# EAGLE design okinesio_v01 (EAGLE 7.5.0)
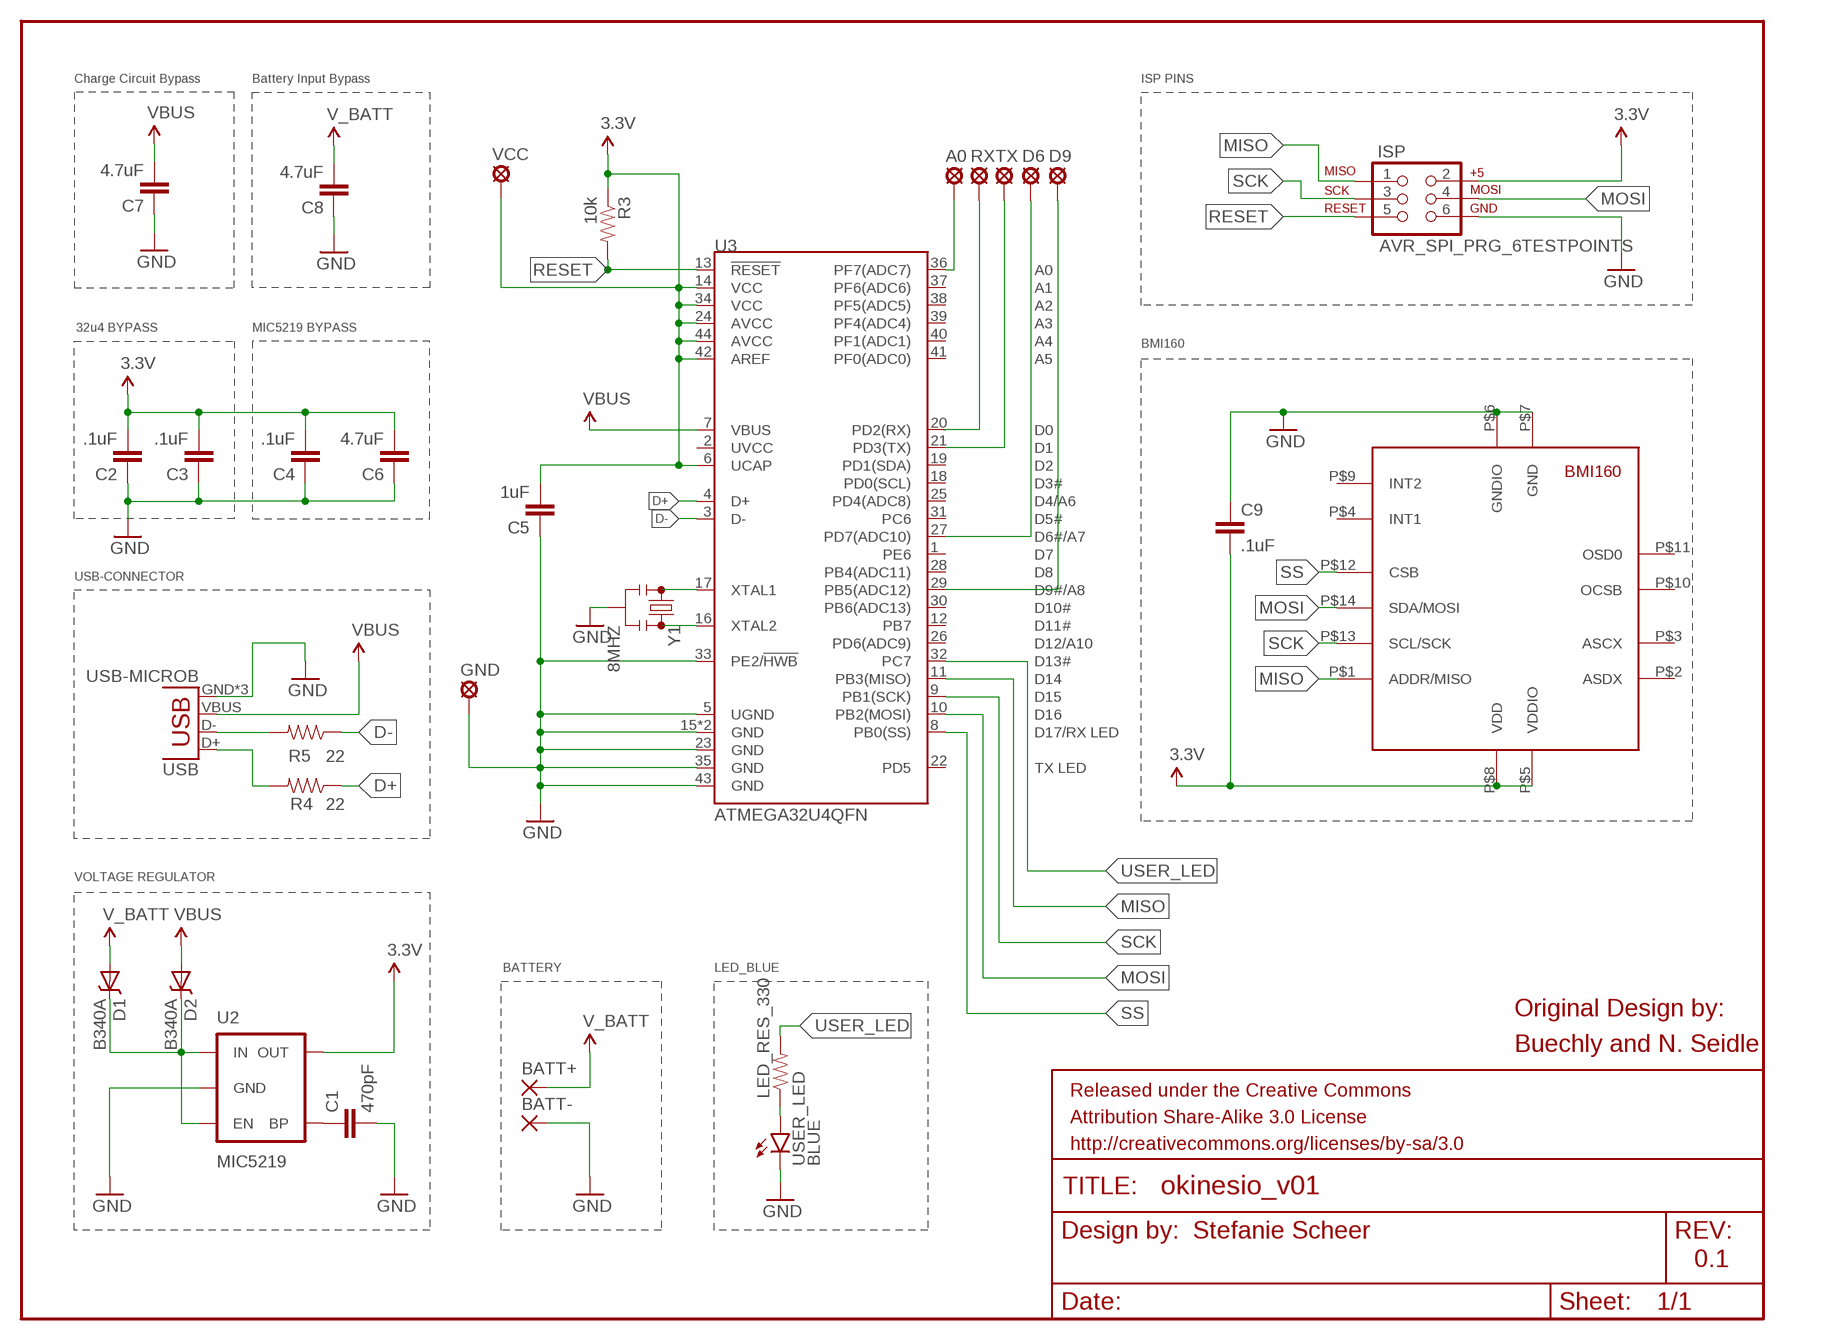
[diagram p0: schematic, sheet 1]

## Parts
A0  LSP10  [LSP10]
BATT+  SMD2  [SMD1,27-2,54]
BATT-  SMD2  [SMD1,27-2,54]
C1  470pF  CAP0603-CAP  [0603-CAP]
C2  .1uF  CAP0603-CAP  [0603-CAP]
C3  .1uF  CAP0603-CAP  [0603-CAP]
C4  .1uF  CAP0603-CAP  [0603-CAP]
C5  1uF  CAP0603-CAP  [0603-CAP]
C6  4.7uF  CAP0603-CAP  [0603-CAP]
C7  4.7uF  CAP1206  [1206]
C8  4.7uF  CAP1206  [1206]
C9  .1uF  CAP0603-CAP  [0603-CAP]
D1  B340A  DIODE-SCHOTTKY_  [SMA-DIODE]
D2  B340A  DIODE-SCHOTTKY_  [SMA-DIODE]
D6  LSP10  [LSP10]
D9  LSP10  [LSP10]
GND  LSP10  [LSP10]
ISP  AVR_SPI_PRG_6TESTPOINTS  [2X3_TEST_POINTS]
LED_RES_330  RESISTOR0603  [0603-RES]
R3  10k  RESISTOR0603-RES  [0603-RES]
R4  22  RESISTOR0603-RES  [0603-RES]
R5  22  RESISTOR0603-RES  [0603-RES]
RX  LSP10  [LSP10]
TX  LSP10  [LSP10]
U2  MIC5219  V_REG_MIC5219SMD  [SOT23-5]
U3  ATMEGA32U4QFN  [QFN-44]
U$3  BMI160LGA14  [LGA14-BMI160]
USB  USB-MICROB  [USB-MICROB]
USER_LED  BLUE  LED-BLUE0603  [LED-0603]
VCC  LSP10  [LSP10]
Y1  8MHZ  RESONATOR8MHZ  [RESONATOR-SMD]

## Nets
3.3V: C2.2 C3.2 C4.2 C5.2 C6.2 C9.2 ISP.2 R3.1 U2.5(OUT) U3.6(UCAP) U3.14(VCC) U3.24(AVCC) U3.34(VCC) U3.42(AREF) U3.44(AVCC) U$3.P$5(VDDIO) U$3.P$8(VDD) VCC.MP
5V: C7.2 D2.A U3.7(VBUS) USB.VBUS ; supply symbol labelled VBUS
D+: R4.1 U3.4(D+)
D-: R5.1 U3.3(D-)
GND: BATT-.1(P) C1.2 C2.1 C3.1 C4.1 C5.1 C6.1 C7.1 C8.1 C9.1 GND.MP ISP.6 U2.2(GND) U3.5(UGND) U3.15(GND) U3.23(GND) U3.33(PE2/!HWB) U3.35(GND) U3.43(GND) U3.EPAD(GND) U$3.P$6(GNDIO) U$3.P$7(GND) USB.GND USB.MT1(GND) USB.MT2(GND) USER_LED.C Y1.2
MISO: ISP.1 U3.11(PB3(MISO)) U$3.P$1(ADDR/MISO)
MOSI: ISP.4 U3.10(PB2(MOSI)) U$3.P$14(SDA/MOSI)
N$1: D1.C D2.C U2.1(IN) U2.3(EN)
N$2: D6.MP U3.27(PD7(ADC10))
N$3: TX.MP U3.21(PD3(TX))
N$4: A0.MP U3.36(PF7(ADC7))
N$5: U3.17(XTAL1) Y1.1
N$6: D9.MP U3.29(PB5(ADC12))
N$7: LED_RES_330.1 USER_LED.A
N$8: C1.1 U2.4(BP)
N$9: RX.MP U3.20(PD2(RX))
N$10: U3.16(XTAL2) Y1.3
N$13: R5.2 USB.D-
N$14: R4.2 USB.D+
RESET: ISP.5 R3.2 U3.13(!RESET)
SCK: ISP.3 U3.9(PB1(SCK)) U$3.P$13(SCL/SCK)
SS: U3.8(PB0(SS)) U$3.P$12(CSB)
USER_LED: LED_RES_330.2 U3.32(PC7)
V_BATT: BATT+.1(P) C8.2 D1.A
Unconnected: U3.1(PE6) U3.2(UVCC) U3.12(PB7) U3.18(PD0(SCL)) U3.19(PD1(SDA)) U3.22(PD5) U3.25(PD4(ADC8)) U3.26(PD6(ADC9)) U3.28(PB4(ADC11)) U3.30(PB6(ADC13)) U3.31(PC6) U3.37(PF6(ADC6)) U3.38(PF5(ADC5)) U3.39(PF4(ADC4)) U3.40(PF1(ADC1)) U3.41(PF0(ADC0)) U$3.P$2(ASDX) U$3.P$3(ASCX) U$3.P$4(INT1) U$3.P$9(INT2) U$3.P$10(OCSB) U$3.P$11(OSD0)

## Notes on the sheet
- Charge Circuit Bypass | Battery Input Bypass | ISP PINS
- 32u4 BYPASS | MIC5219 BYPASS
- BMI160
- USB-CONNECTOR
- VOLTAGE REGULATOR
- BATTERY | LED_BLUE
- Original Design by:
- Buechly and N. Seidle
- Stefanie Scheer
- 0.1

## Library data of the parts
A0 D6 D9 GND RX TX VCC = solpad:LSP10: SOLDER PAD drill 1.0 mm, distributor Buerklin, 12H555
BATT+ BATT- = wirepad_3x2:SMD2: SMD PAD
C1 = SparkFun-Passives:CAP: Capacitor Standard 0603 ceramic capacitor, and 0.1" leaded capacitor.; PROD_ID: CAP-07884
C2-C4 C9 = SparkFun-Passives:CAP: Capacitor Standard 0603 ceramic capacitor, and 0.1" leaded capacitor.; PROD_ID: CAP-00810
C5 = SparkFun-Passives:CAP: Capacitor Standard 0603 ceramic capacitor, and 0.1" leaded capacitor.; PROD_ID: CAP-00868
C6 = SparkFun-Passives:CAP: Capacitor Standard 0603 ceramic capacitor, and 0.1" leaded capacitor.; PROD_ID: CAP-08280
C7 C8 = SparkFun-Passives:CAP: Capacitor Standard 0603 ceramic capacitor, and 0.1" leaded capacitor.; PROD_ID: CAP-10300
D1 D2 = SparkFun-DiscreteSemi:DIODE-SCHOTTKY: Commonly MBRA140.; PROD_ID: DIO-09886
ISP = SparkFun-Connectors_usb_neu_2:AVR_SPI_PRG_6: AVR ISP 6 Pin This is the reduced ISP connector for AVR programming. Common on Arduino. This footprint will take up less PCB space and can be used with a 10-pin to 6-pin adapter such as SKU: BOB-08508 **Special note about "TEST_POINT" package. The stop mask is on the top side, so if you want your programming test points to be on the bottom of your board, make sure to place this package on the bottom side of the board. This also ensure that the orientation to program from the bottom side will be correct.
LED_RES_330 = SparkFun-Resistors:RESISTOR: Resistor Basic schematic elements and footprints for 0603, 1206, and PTH resistors.
R3 = SparkFun-Passives:RESISTOR: Resistor Basic schematic elements and footprints for 0603, 1206, and PTH resistors.; PROD_ID: RES-00824
R4 R5 = SparkFun-Passives:RESISTOR: Resistor Basic schematic elements and footprints for 0603, 1206, and PTH resistors.; PROD_ID: RES-08698
U2 = SparkFun-PowerIC:V_REG_MIC5219: V_REG MIC5219 Standard 500mA LDO voltage regulator in SOT-23 layout. Micrel part MIC5219. BP (by-pass) pin is used to lower output noise with 470pF cap, may be left open.; PROD_ID: VREG-09872
U3 = SparkFun-DigitalIC:ATMEGA32U4: Atmel 44-pin 8-bit Microcontroller with 32KBytes of ISP Flash and USB Controller; PROD_ID: IC-10828
U$3 = User-Submitted:BMI160: BMI160 Internal Measurement Unit
USB = SparkFun-Connectors_usb_neu_2:USB: USB Connectors USB-B-PTH is fully proven SKU : PRT-00139/CONN-08278 USB-miniB is fully proven SKU : PRT-00587 USB-A-PCB is untested. USB-A-H is throughly reviewed, but untested. Spark Fun Electronics SKU : PRT-00437 USB-B-SMT is throughly reviewed, but untested. Needs silkscreen touching up. USB-A-S has not been used/tested USB-MB-H has not been used/tested USB-MICROB has been used. CONN-09505; PROD_ID: CONN-09505
USER_LED = SparkFun-LED:LED-BLUE: Blue LEDs for production use Various blue LEDs stocked by SparkFun production 0603 - DIO-08575 Rebel - DIO-09553 1206 - DIO-09911; PROD_ID: DIO-08575
Y1 = SparkFun-FreqCtrl:RESONATOR: Resonator Small SMD resonator. Used, eg, on the Arduino Pro/ Pro Mini boards. 8MHz- XTAL-08895 16MHz- XTAL-08900; PROD_ID: XTAL-08895

## Board
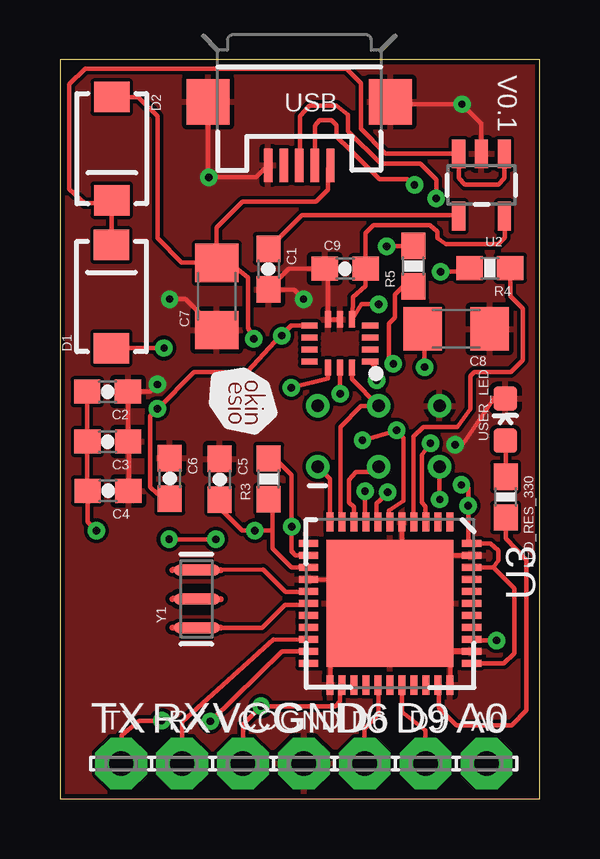
[diagram p1: board, top side]
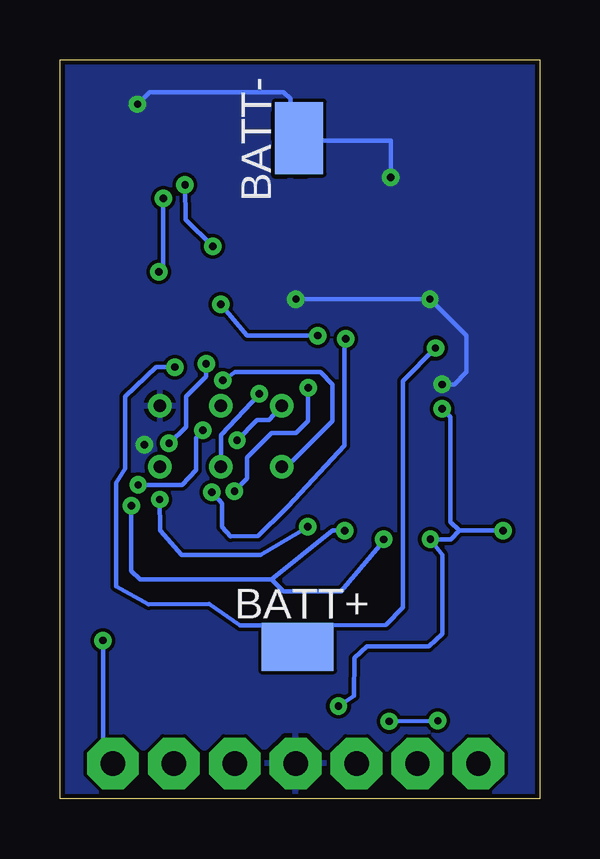
[diagram p2: board, bottom side, seen from below]

Size 20 x 30.8 mm. Coordinates in mm from the lower left corner, seen from the top.
Outline: 0,0 20,0 20,30.8 0,30.8 0,0
Copper layers (1*16): Top 0.035mm / dielectric 1.5mm / Bottom 0.035mm
Design rules "Eagle-DRU LochLP GmbH - 01 and 02 layers - 35mue *": minimum track width 0.15mm, minimum drill 0.3mm, track to track 0.15mm, track to pad 0.15mm, pad to pad 0.15mm, via to via 0.15mm, smd to smd 0.15mm, copper to edge 0.2mm, drill to drill 0.25mm, minimum pad ring 0.23mm, minimum via ring 0.21mm, stop-mask expansion 0.05mm, vias tented up to drill 12mil, thermal gap 0.2mm

### Footprints (pad centres in the part's own frame; a part is rotated, then mirrored left to right if it is on the bottom)
LSP10 = drill 1.016 pad 2.159 octagon: MP 0,0
SMD1,27-2,54 = smd 1.27 x 2.54: 1 0,0 | smd 2 x 3: P$1 0.362,0.235
0603-CAP = smd 1.1 x 1: 1 -0.85,0; 2 0.85,0
1206 = smd 1.6 x 1.8: 1 -1.4,0; 2 1.4,0
SMA-DIODE = smd 1.27 x 1.47: A -2.15,0; C 2.15,0
2X3_TEST_POINTS = drill 0.508: 1 -2.54,-1.27; 2 -2.54,1.27; 3 0,-1.27; 4 0,1.27; 5 2.54,-1.27; 6 2.54,1.27
0603-RES = smd 1.1 x 1: 1 -0.85,0; 2 0.85,0
SOT23-5 = smd 0.55 x 1.2: 1 -0.95,-1.3; 2 0,-1.3; 3 0.95,-1.3; 4 0.95,1.3; 5 -0.95,1.3
QFN-44 = smd 0.8 x 0.3: 1 -3.4,2.5; 2 -3.4,2; 3 -3.4,1.5; 4 -3.4,1; 5 -3.4,0.5; 6 -3.4,0; 7 -3.4,-0.5; 8 -3.4,-1; 9 -3.4,-1.5; 10 -3.4,-2; 11 -3.4,-2.5; 23 3.4,-2.5; 24 3.4,-2; 25 3.4,-1.5; 26 3.4,-1; 27 3.4,-0.5; 28 3.4,0; 29 3.4,0.5; 30 3.4,1; 31 3.4,1.5; 32 3.4,2; 33 3.4,2.5 | smd 0.3 x 0.8: 12 -2.5,-3.4; 13 -2,-3.4; 14 -1.5,-3.4; 15 -1,-3.4; 16 -0.5,-3.4; 17 0,-3.4; 18 0.5,-3.4; 19 1,-3.4; 20 1.5,-3.4; 21 2,-3.4; 22 2.5,-3.4; 34 2.5,3.4; 35 2,3.4; 36 1.5,3.4; 37 1,3.4; 38 0.5,3.4; 39 0,3.4; 40 -0.5,3.4; 41 -1,3.4; 42 -1.5,3.4; 43 -2,3.4; 44 -2.5,3.4 | smd 5.3 x 5.3: EPAD 0,0
LGA14-BMI160 = smd 0.675 x 0.25: P$1 -1.262,0.75; P$2 -1.262,0.25; P$3 -1.262,-0.25; P$4 -1.262,-0.75; P$8 1.262,-0.75; P$9 1.262,-0.25; P$10 1.262,0.25; P$11 1.262,0.75 | smd 0.25 x 0.675: P$5 -0.5,-1.012; P$6 0,-1.012; P$7 0.5,-1.012; P$12 0.5,1; P$13 0,1; P$14 -0.5,1
USB-MICROB = smd 0.35 x 1.4: D+ 0,2.65; D- -0.65,2.65; GND 1.3,2.65; ID 0.65,2.65; VBUS -1.3,2.65 | smd 1.8 x 1.9: MT1 -3.8,0; MT2 3.8,0
LED-0603 = smd 1 x 1: A 0,-0.877; C 0,0.877
RESONATOR-SMD = smd 0.45 x 1.905: 1 -1.2,0; 2 0,0; 3 1.2,0

### Placement (x,y rotation side)
A0  17.79,1.47 0 top
BATT+  10.32,6.7 270 bottom
BATT-  10.38,27.3 0 bottom
C1  8.7,22.08 270 top
C2  1.99,16.98 180 top
C3  2,14.89 180 top
C4  2.01,12.84 180 top
C5  6.67,13.32 270 top
C6  4.58,13.35 270 top
C7  6.54,20.94 90 top
C8  16.52,19.59 180 top
C9  11.9,22.1 0 top
D1  2.15,20.94 90 top
D2  2.16,27.1 270 top
D6  12.71,1.47 0 top
D9  15.25,1.47 0 top
GND  10.17,1.47 0 top
ISP  13.29,15.11 0 top
LED_RES_330  18.59,12.58 270 top
R3  8.71,13.34 90 top
R4  17.93,22.13 180 top
R5  14.74,22.2 90 top
RX  5.09,1.47 0 top
TX  2.55,1.47 0 top
U2  17.58,25.59 180 top
U3  13.77,8.14 270 top
U$3  11.67,18.97 180 top
USB  9.98,29.06 180 top
USER_LED  18.57,15.81 0 top
VCC  7.63,1.47 0 top
Y1  5.7,8.33 90 top

### Tracks (layer width: path | path; a pad name or v marks a point on that pad's centre or on a via)
3.3V  (via drill 0.3 pad 0.25)
  Top 0.178: 18.07,9.64 18.28,9.94 18.28,10.36 17.95,10.65 U3.44 17.02,10.78 v17.02,12.22 17.02,12.95 v16.74,13.09 | 18.07,9.64 U3.42 | U3.34 18.52,5.64 18.95,6.07 18.95,8.77 18.07,9.64 | 6.83,12.75 C5.2 6.67,12.16 6.63,12.13 7.59,11.18 v8.12,11.18 v8.13,11.18 8.86,11.18 | v9.24,19.31 9.66,19.72 U$3.P$8 9.63,19.72 9.21,19.3 9.19,19.3 7.79,17.78 5.59,17.78 v4.06,16.26 v4.06,16.25 3.76,15.95 3.76,13 4.06,12.7 4.61,12.7 C6.2 | v13.29,20.61 12.57,20.61 U$3.P$5 12.2,20.01 12.21,20.91 12.74,21.37 C9.2 12.74,22.73 12.74,23.58 13.08,23.92 15.43,23.92 15.44,23.92 15.75,23.64 15.75,23.37 16.09,23.11 18.28,23.11 18.55,23.39 18.55,24.28 18.54,24.29 | C2.2 1.14,14.9 C3.2 1.15,12.8 C4.2 1.16,11.54 v1.52,11.18 | 8.86,11.18 8.86,10.44 9.65,9.65 10.35,9.65 U3.14 | v6.5,10.81 6.34,10.82 v4.55,10.82 | 8.86,11.18 8.86,12.33 R3.1 | v12.61,14.94 v14.05,15.36 14.33,15.03 14.33,12.42 13.72,12.02 13.72,11.59 U3.6 | U3.24 11.68,4.66 11.68,4.06 11.48,3.86 v8.39,3.86 7.63,3.11 VCC.MP
  Top 0.254: U2.5 18.54,24.29
  Bottom 0.178: v9.24,19.31 12.2,19.31 v13.29,20.61 | v1.52,11.18 3.34,11.18 | 3.34,11.18 3.71,11.55 3.71,15.9 v4.06,16.26 | v17.02,12.22 17.02,9.51 16.66,9.14 11.18,9.14 | 11.18,9.14 8.64,11.18 v8.13,11.18 | 11.18,9.14 10.67,8.64 8.29,8.64 6.67,10.54 v6.5,10.81 | v8.39,3.86 7.75,4.29 7.73,5.88 7.2,6.35 4.62,6.35 4.06,6.88 4.06,10.16 v4.55,10.82 3.7,10.82 3.34,11.18 | v12.61,14.94 11.78,15.79 11.27,15.79 10.87,16.24 10.75,16.36 ISP.2 | v16.74,13.09 14.91,13.09 14.33,13.72 14.33,15.04 v14.05,15.36
5V  (via drill 0.3 pad 0.25)
  Top 0.178: D2.A 3.26,29.25 4.06,28.45 4.06,23.37 5.08,22.35 6.53,22.35 C7.2 | 6.6,22.41 C7.2 | C7.2 7.09,22.34 7.84,21.73 7.84,19.62 v8.09,19.17 | U3.7 13.21,11.6 13.21,12.31 13.5,12.59 v13.66,12.79 | USB.VBUS 11.18,26.3 11.18,25.4 10.67,24.89 7.62,24.89 6.54,23.81 C7.2
  Bottom 0.178: v8.09,19.17 8.14,18.92 8.13,14.73 10.5,12.19 10.62,12.06 11.73,10.95 12.89,10.94 13.23,11.34 13.23,12.32 v13.66,12.79
D+
  Top 0.178: R4.1 18.78,20.96 19.14,20.6 19.3,20.44 19.3,18.29 18.8,17.78 17.27,17.78 17.11,17.62 17.11,17.34 17.11,16.26 16.57,15.51 15.16,15.51 14.73,15.09 14.73,11.57 U3.4
D-  (via drill 0.3 pad 0.25)
  Top 0.178: U3.3 15.23,11.57 15.24,11.58 15.24,12.19 15.09,12.34 15.09,14.34 15.39,14.74 v15.45,14.82 | v13.9,18.13 13.72,18.32 13.72,19.81 13.97,20.07 13.97,21.03 14.3,21.35 R5.1
  Bottom 0.178: v15.45,14.82 14.73,15.5 14.73,16.76 13.9,17.59 v13.9,18.13
GND  (via drill 0.3 pad 0.25)
  Top 0.178: U3.5 14.27,10.62 | 14.27,10.62 14.28,8.09 | 16.28,6.13 16.28,5 | U3.35 13.77,6.14 | U3.EPAD 13.77,6.14 11.28,6.14 U3.23 | U3.15 13.78,9.11 | U3.43 16.3,10.14 | 16.29,10.64 14.27,10.62 | 11.27,4.68 U3.23 | C7.1 5.25,20.83 v4.57,20.83 | 17.59,26.9 U2.2 17.57,28.14 v16.76,28.96 13.88,28.96 USB.MT1 | 2.8,14.93 C3.1 | C8.1 17.39,19.06 | C1.2 8.82,21.23 | 6.17,29.04 USB.MT2 6.18,26 v6.2,25.91 8.19,25.91 USB.GND 8.69,26.4 8.69,26.34 | USER_LED.C 18.11,16.7 16.76,14.73 v16.48,14.76 | C9.1 9.56,22.1 C1.2 9.76,21.23 v10.16,20.83 | C9.1 11.17,21.97 U$3.P$7 U$3.P$6 | C9.1 | v4.06,17.27 3.77,16.98 C2.1 C3.1 | 4.72,14.48 C6.1 | C3.1 C4.1 2.85,12.8 2.88,12.8 2.88,14.89 C3.1 | 6.63,14.48 C5.1
  Top 0.254: 14.28,8.09 U3.EPAD 13.78,9.11 | U3.35 16.91,6.13 16.28,6.13 | 16.28,5 U3.33 | 16.3,10.14 16.29,10.64 | U3.23 | 13.77,6.14 | C1.2
  Bottom 0.178: v6.2,25.91 6.19,27.43 10.26,27.43 BATT-.1 10.38,29.18 10.67,29.46 16.26,29.46 v16.76,28.96 | v10.16,20.83 v4.57,20.83 3.05,19.3 3.05,17.78 3.56,17.27 v4.06,17.27
  pour Top: 0,30.99 20.32,30.99 20.32,-0.51 0,-0.51
  pour Bottom (isolate 0.018): 0,30.99 20.32,30.99 20.32,-0.51 0,-0.51
MISO  (via drill 0.3 pad 0.25)
  Top 0.178: 11.22,11.49 U3.11 11.27,13.33 ISP.1 | v13.21,17.44 13.21,17.95 U$3.P$1
  Bottom 0.178: ISP.1 10.54,13.84 8.64,15.75 8.64,17.27 9.14,17.78 12.7,17.78 v13.21,17.44
MOSI
  Top 0.178: U3.10 11.77,11.62 11.69,11.71 11.7,15.5 12.55,16.37 ISP.4 12.17,17.5 U$3.P$14
N$1
  Top 0.178: 2.15,24.95 D1.C | 16.62,26.89 U2.3 | U2.3 16.62,25.87 16.89,25.61 18.27,25.61 18.53,25.86 U2.1 | 16.62,26.89 U2.3 | D2.C 2.04,24.83 1.02,24.83 0.38,25.42 0.38,29.8 1.05,30.43 11.95,30.43 12.54,29.83 12.54,27.93 13.58,26.89 U2.3
  Top 0.254: U2.1 18.52,26.89 | D2.C 2.15,24.95
N$2
  Top 0.178: D6.MP 12.7,2.91 13.28,3.54 13.28,4.72 U3.27
N$3  (via drill 0.3 pad 0.25)
  Top 0.178: TX.MP 2.54,1.51 2.56,2.64 3.3,3.25 v4.24,3.25 | U3.21 9.27,6.14 v6.27,3.23
  Bottom 0.178: v6.27,3.23 v4.24,3.25
N$4  (via drill 0.3 pad 0.25)
  Top 0.178: v18.2,6.6 17.16,6.6
  Top 0.254: 17.16,6.6 U3.36
  Bottom 0.178: v18.2,6.6 18.21,1.47 A0.MP
N$5
  Top 0.178: U3.17 10.31,8.09 9.39,8.09 8.43,7.13 6.72,7.13
N$6
  Top 0.178: D9.MP 15.25,1.51 15.25,2.85 14.27,3.63 U3.29
N$7
  Top 0.178: LED_RES_330.1 18.59,14.93
  Top 0.254: 18.59,14.93 USER_LED.A
N$8
  Top 0.178: C1.1 10.1,24.34 15.54,24.34 16.62,24.34 U2.4
  Top 0.254: U2.4 16.64,24.51
N$9
  Top 0.178: U3.20 10.35,6.63 8.9,6.63 5.1,3.2 RX.MP
N$10
  Top 0.178: U3.16 10.35,8.62 9.41,8.62 8.48,9.56 6.72,9.53
N$13  (via drill 0.3 pad 0.25)
  Top 0.178: USB.D- 10.63,28.06 10.82,28.28 11.33,28.28 11.53,28.09 11.53,27.61 12.08,27.09 | v13.63,23.03 14.72,23.03 R5.2 | 12.08,27.09 | 12.08,27.09 13.32,25.83 14.49,25.83 v14.79,25.59
  Bottom 0.178: v14.79,25.59 14.77,24.13 v13.63,23.03
N$14  (via drill 0.3 pad 0.25)
  Top 0.178: v15.69,25.02 15.69,25.8 15.03,26.47 13.38,26.47 12.01,27.84 12.01,28.51 11.54,28.88 10.4,28.88 10.01,28.46 10.01,26.43 USB.D+ | v15.87,21.97 16.92,21.97 R4.2
  Bottom 0.178: v15.69,25.02 15.69,22.15 v15.87,21.97
RESET  (via drill 0.3 pad 0.25)
  Top 0.178: R3.2 8.97,14.19 9.65,13.51 9.65,10.32 9.83,10.14 U3.13 9.83,10.14 9.65,10.32 9.65,11.96 v9.66,11.34 | ISP.5 15.83,12.52 v15.84,12.48
  Bottom 0.178: v9.66,11.34 11.63,10.16 14.93,10.17 15.82,11.18 15.83,11.2 v15.84,12.48
SCK  (via drill 0.3 pad 0.25)
  Top 0.178: U$3.P$13 11.68,17.96 v11.68,16.88 | ISP.3 13.07,13.62 12.35,13.62 12.05,13.29 12.05,12.35 12.27,12.16 U3.9
  Bottom 0.178: v11.68,16.88 13.29,15.16 ISP.3
SS  (via drill 0.3 pad 0.25)
  Top 0.178: 11.17,17.92 U$3.P$12 11.17,17.52 v9.65,17.13 | U3.8 12.72,11.59 v12.72,12.82
  Bottom 0.178: v12.72,12.82 12.19,13.35 12.19,14.22 11.18,15.24 10.16,15.24 9.65,15.75 v9.65,17.13
USER_LED
  Top 0.178: LED_RES_330.2 18.59,10.85 19.44,9.98 19.46,9.96 19.46,3.67 18.84,3.06 16.53,3.06 15.81,3.79 15.81,4.74
  Top 0.254: 15.81,4.74 U3.32
V_BATT  (via drill 0.3 pad 0.25)
  Top 0.178: 15.2,19.12 v15.2,17.99 | D1.A 3.44,18.79 v4.34,18.79
  Top 0.254: C8.2 14.76,19.5 | 14.76,19.5 15.21,19.09 | 14.76,19.5 15.2,19.12
  Bottom 0.178: v4.34,18.79 5.7,17.41 5.7,12.36 5.7,11.08 5.71,11.08 5.71,7.97 6.4,7.24 8.98,7.23 9.29,7.25 BATT+.1 10.55,7.22 12.48,7.22 13.78,8.12 16.3,8.1 17.66,8.85 17.66,13.16 17.27,13.76 17.27,16.76 15.99,18 v15.2,17.99

### Text on the board
tPlace: V0.1 | TX | RX | VCC | GND | D6 | D9 | A0